# EAGLE design stepdown (EAGLE 7.7.0)
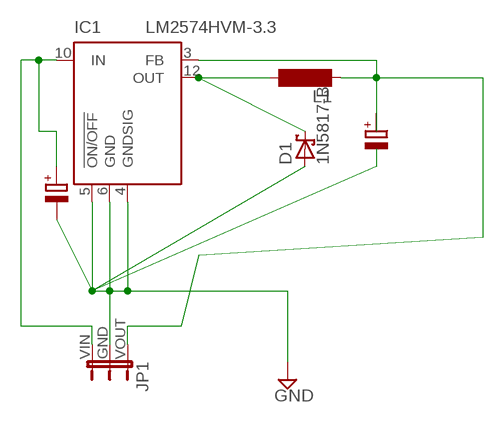
[diagram p0: schematic, sheet 1]

## Parts
D1  1N5817-B  [DO41-7.6]
IC1  LM2574HVM-3.3  [SO14W]
JP1  JP2W  [JP2W]
L1  SM-1206  [SM-1206]

## Nets
GND: D1.A IC1.4(GNDSIG) IC1.5(!ON/OFF) IC1.6(GND) JP1.GND
N$2: D1.C IC1.12(OUT) L1.2
N$3: IC1.10(IN) JP1.VIN
N$4: IC1.3(FB) JP1.VOUT L1.1

## Library data of the parts
D1 = diode:1N581*: 1.0A SCHOTTKY BARRIER RECTIFIER Source: http://www.diodes.com/datasheets/ds23001.pdf
IC1 = linear:LM2574?-*: SIMPLE SWITCHER 0.5A Step-Down Voltage Regulator Source: http://cache.national.com/ds/LM/LM2574.pdf
JP1 = jumper:JP2W: JUMPER
L1 = inductor-neosid:SM-1206: INDUCTOR SMD chip inductor; OC_FARNELL: unknown; OC_NEWARK: unknown

## Board
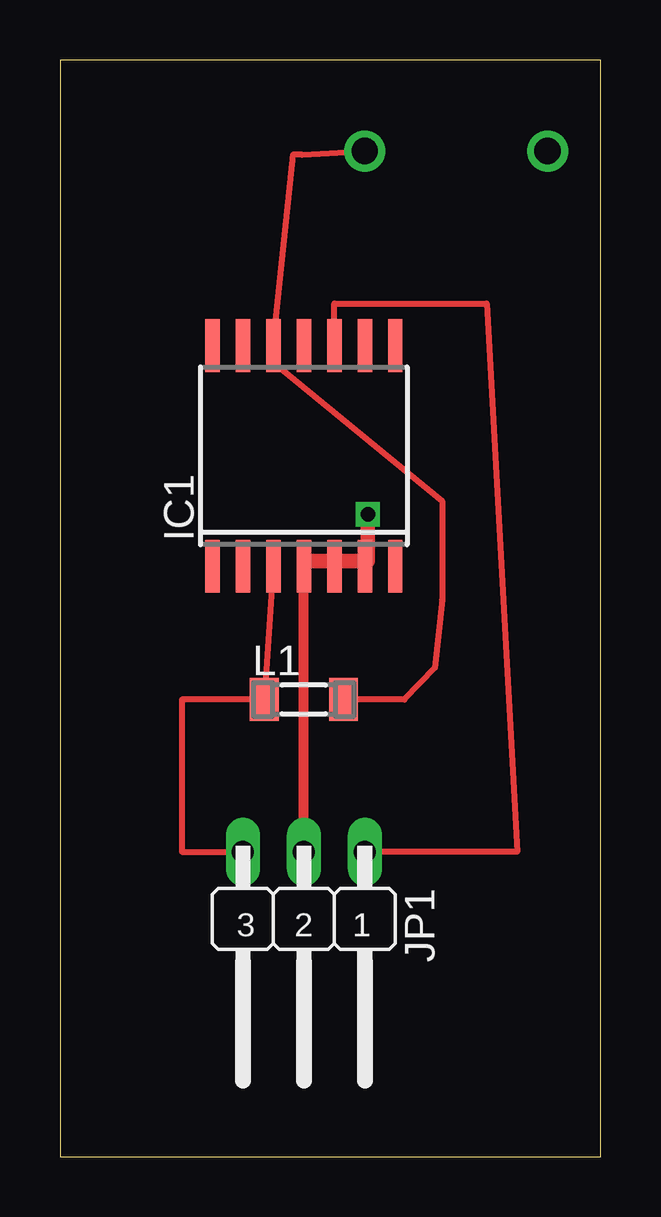
[diagram p1: board, top side]
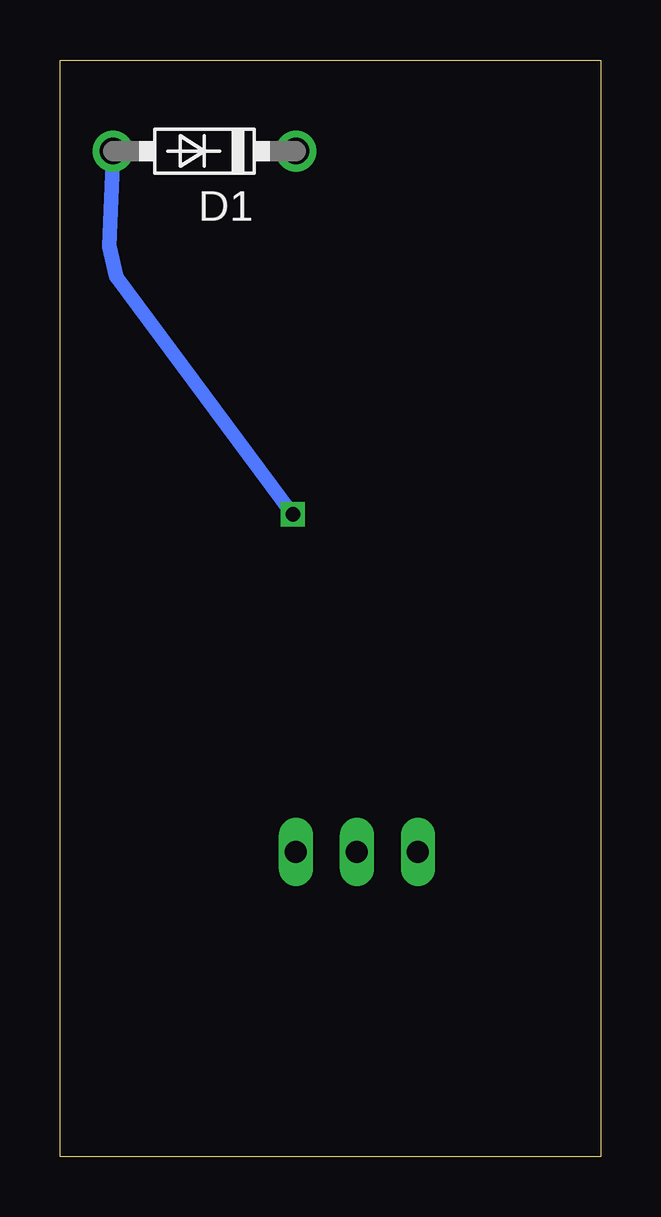
[diagram p2: board, bottom side, seen from below]

Size 22.53 x 45.71 mm. Coordinates in mm from the lower left corner, seen from the top.
Outline: 0,0 22.53,0 22.53,45.71 0,45.71 0,0
Copper layers (1*16): Top 0.035mm / dielectric 1.5mm / Bottom 0.035mm
Design rules "default": minimum track width 10mil, minimum drill 24mil, track to track 8mil, track to pad 8mil, pad to pad 8mil, via to via 8mil, smd to smd 8mil, copper to edge 40mil, drill to drill 8mil, minimum pad ring 10mil, minimum via ring 8mil, stop-mask expansion 4mil, vias tented up to drill 0mil, thermal gap 10mil

### Footprints (pad centres in the part's own frame; a part is rotated, then mirrored left to right if it is on the bottom)
DO41-7.6 = drill 1.1 pad 1.7: A 3.81,0; C -3.81,0
SO14W = smd 0.6 x 2.2: 1 -3.81,-4.6; 2 -2.54,-4.6; 3 -1.27,-4.6; 4 0,-4.6; 5 1.27,-4.6; 6 2.54,-4.6; 7 3.81,-4.6; 8 3.81,4.6; 9 2.54,4.6; 10 1.27,4.6; 11 0,4.6; 12 -1.27,4.6; 13 -2.54,4.6; 14 -3.81,4.6
JP2W = drill 0.914 long: 1 -2.54,-1.27; 2 0,-1.27; GND 0,-1.27; VIN -2.54,-1.27; VOUT 2.54,-1.27
SM-1206 = smd 1.2 x 1.8: 1 -1.65,0; 2 1.65,0

### Placement (x,y rotation side)
D1  16.51,41.91 180 bottom
IC1  10.16,29.21 0 top
JP1  10.16,11.43 180 top
L1  10.16,19.05 0 top

### Tracks (layer width: path | path; a pad name or v marks a point on that pad's centre or on a via)
GND  (via drill 0.6)
  Top 0.254: 10.31,24.82 IC1.4 | 11.23,24.82 IC1.5 11.45,24.82 | 12.6,24.82 IC1.6 12.83,24.82
  Top 0.406: JP1.GND IC1.4 10.16,25.4
  Top 0.61: 11.23,24.82 10.31,24.82 | 11.45,24.82 12.6,24.82 | 12.83,24.82 v12.83,26.77
  Bottom 0.61: v12.83,26.77 20.19,36.68 20.47,37.95 D1.A
N$2
  Top 0.254: D1.C 10.08,41.76 9.7,41.76 8.94,34.65 8.94,33.96 IC1.12 8.94,33.73 8.94,33.05 15.93,27.33 15.93,23.22 15.62,20.37 14.35,19.05 L1.2
N$3
  Top 0.254: IC1.10 11.43,35.56 17.78,35.56 19.05,12.7 JP1.VIN
N$4
  Top 0.254: JP1.VOUT 5.08,12.7 5.08,13.97 5.08,19.05 L1.1 IC1.3